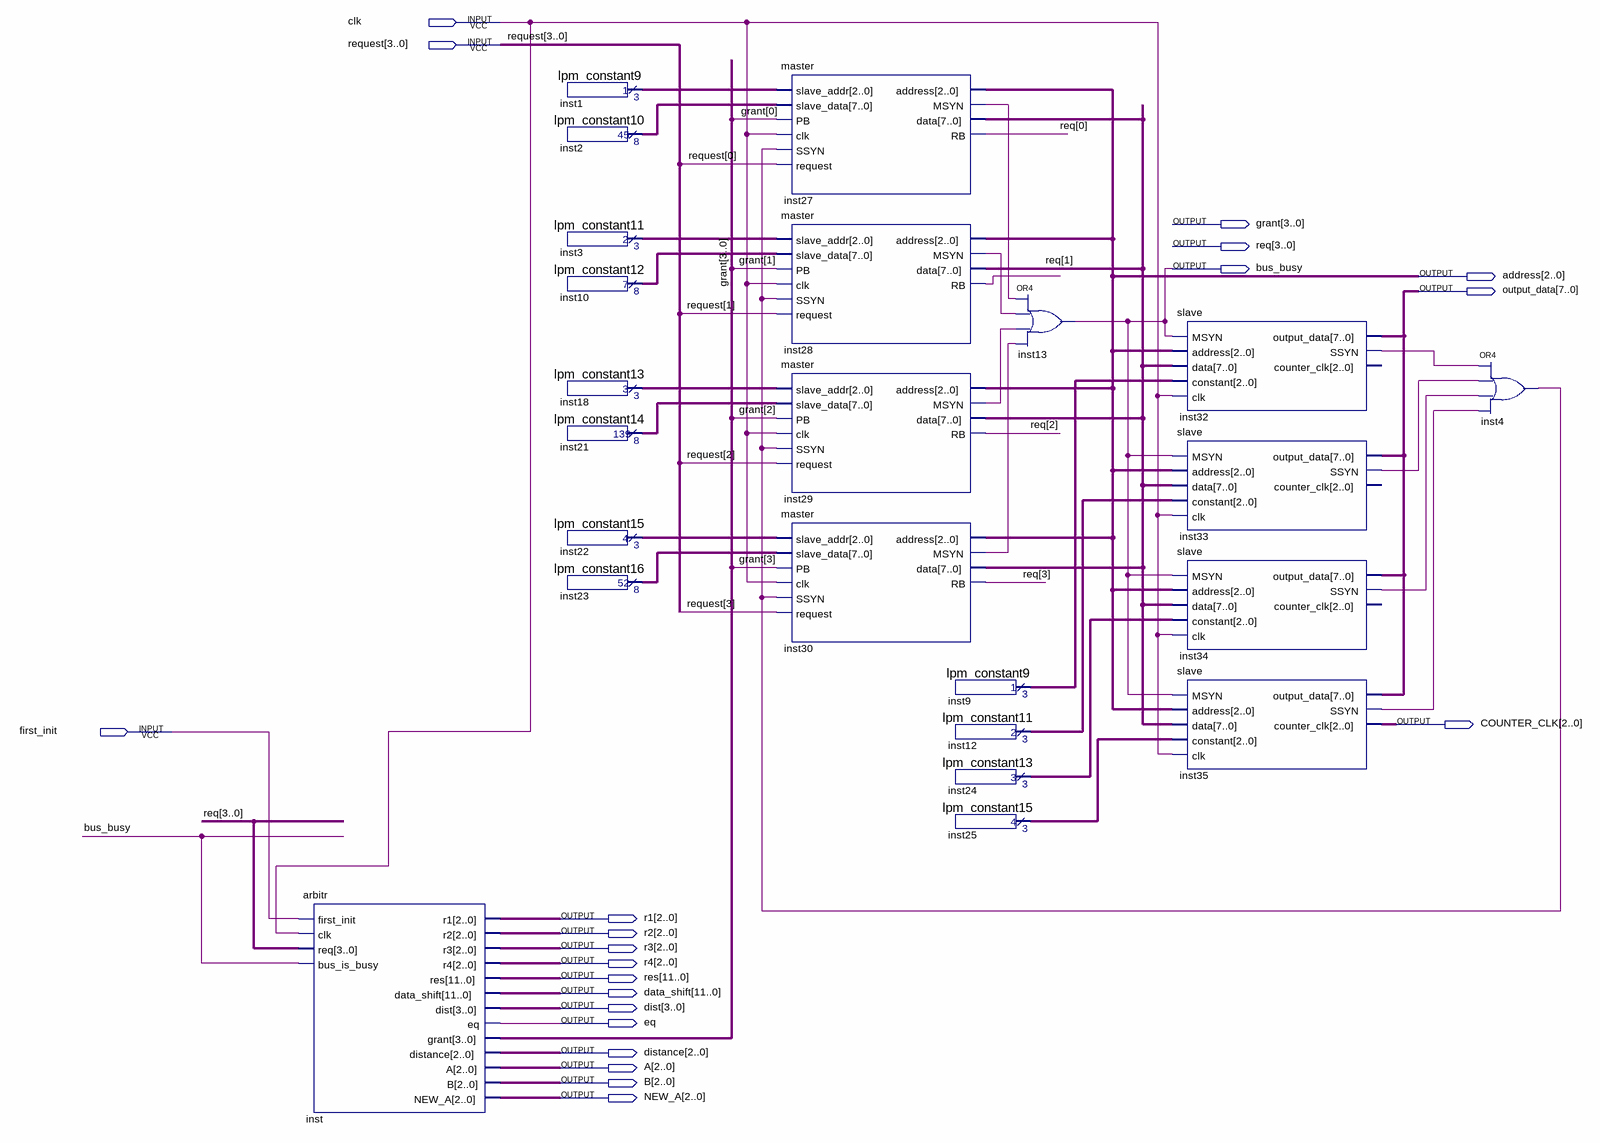
[diagram p0: schematic sheet]
// Quartus schematic lab7.bdf as structural Verilog: 23 symbols, 21 pins
module lab7 (
  input  clk,
  input  [3:0] request,
  input  first_init,
  output [3:0] grant,
  output [3:0] req,
  output bus_busy,
  output [2:0] address,
  output [7:0] output_data,
  output [2:0] COUNTER_CLK,
  output [2:0] r1,
  output [2:0] r2,
  output [2:0] r3,
  output [2:0] r4,
  output [11:0] res,
  output [11:0] data_shift,
  output [3:0] \dist ,
  output eq,
  output [2:0] distance,
  output [2:0] A,
  output [2:0] B,
  output [2:0] NEW_A
);

  wire inst4_out, inst27_msyn, inst28_msyn, inst29_msyn, inst30_msyn, inst32_ssyn, inst33_ssyn, inst34_ssyn,
       inst35_ssyn;
  wire [2:0] inst1_result, inst3_result, inst9_result, inst12_result, inst18_result, inst22_result,
       inst24_result, inst25_result;
  wire [7:0] inst2_result, inst10_result, inst21_result, inst23_result, inst27_data;

  arbitr inst (
    .first_init(first_init), .clk(clk), .req(req), .bus_is_busy(bus_busy), .r1(r1), .r2(r2), .r3(r3),
    .r4(r4), .res(res), .data_shift(data_shift), .\dist (\dist ), .eq(eq), .grant(grant),
    .distance(distance), .A(A), .B(B), .NEW_A(NEW_A));
  lpm_constant9 inst1 (.result(inst1_result));
  lpm_constant10 inst2 (.result(inst2_result));
  lpm_constant11 inst3 (.result(inst3_result));
  lpm_constant12 inst10 (.result(inst10_result));
  lpm_constant13 inst18 (.result(inst18_result));
  lpm_constant14 inst21 (.result(inst21_result));
  lpm_constant15 inst22 (.result(inst22_result));
  lpm_constant16 inst23 (.result(inst23_result));
  master inst27 (
    .slave_addr(inst1_result), .slave_data(inst2_result), .PB(grant[0]), .clk(clk), .SSYN(inst4_out),
    .request(request[0]), .address(address), .MSYN(inst27_msyn), .data(inst27_data), .RB(req[0]));
  master inst28 (
    .slave_addr(inst3_result), .slave_data(inst10_result), .PB(grant[1]), .clk(clk), .SSYN(inst4_out),
    .request(request[1]), .address(address), .MSYN(inst28_msyn), .data(inst27_data), .RB(req[1]));
  master inst29 (
    .slave_addr(inst18_result), .slave_data(inst21_result), .PB(grant[2]), .clk(clk), .SSYN(inst4_out),
    .request(request[2]), .address(address), .MSYN(inst29_msyn), .data(inst27_data), .RB(req[2]));
  master inst30 (
    .slave_addr(inst22_result), .slave_data(inst23_result), .PB(grant[3]), .clk(clk), .SSYN(inst4_out),
    .request(request[3]), .address(address), .MSYN(inst30_msyn), .data(inst27_data), .RB(req[3]));
  lpm_constant9 inst9 (.result(inst9_result));
  lpm_constant11 inst12 (.result(inst12_result));
  lpm_constant13 inst24 (.result(inst24_result));
  lpm_constant15 inst25 (.result(inst25_result));
  or inst13 (bus_busy, inst27_msyn, inst28_msyn, inst29_msyn, inst30_msyn);
  slave inst32 (
    .MSYN(bus_busy), .address(address), .data(inst27_data), .constant(inst9_result), .clk(clk),
    .output_data(output_data), .SSYN(inst32_ssyn));  // open: counter_clk
  slave inst33 (
    .MSYN(bus_busy), .address(address), .data(inst27_data), .constant(inst12_result), .clk(clk),
    .output_data(output_data), .SSYN(inst33_ssyn));  // open: counter_clk
  slave inst34 (
    .MSYN(bus_busy), .address(address), .data(inst27_data), .constant(inst24_result), .clk(clk),
    .output_data(output_data), .SSYN(inst34_ssyn));  // open: counter_clk
  slave inst35 (
    .MSYN(bus_busy), .address(address), .data(inst27_data), .constant(inst25_result), .clk(clk),
    .output_data(output_data), .SSYN(inst35_ssyn), .counter_clk(COUNTER_CLK));
  or inst4 (inst4_out, inst32_ssyn, inst33_ssyn, inst34_ssyn, inst35_ssyn);
endmodule
